# Altium schematic sheet SuCOELora.SchDoc
size A4; SheetNumber: 1; SheetTotal: 4
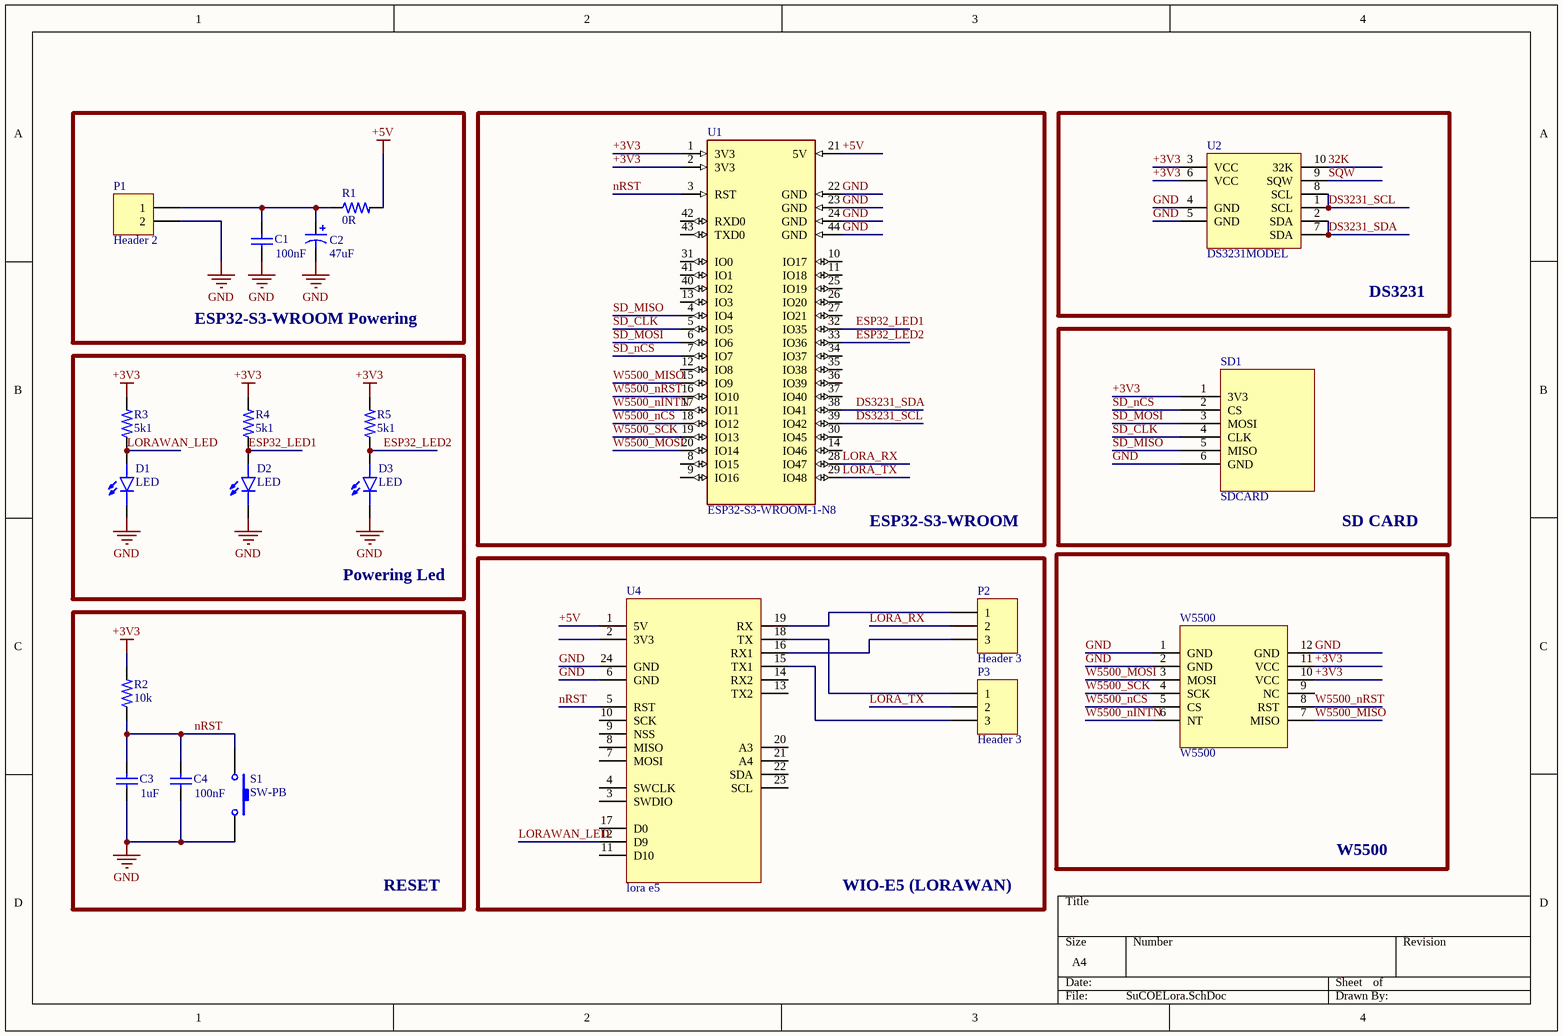
[diagram p0: SuCOELora.SchDoc]

## Parts
C1  value 100nF  [CC0805]  (hidden comment: 0805-50V-100nF±1%)
C2  value 47uF  [SMD-EC-F4]  (hidden comment: SMD-25V-47uF)
C3  value 1uF  [CC0805]  (hidden comment: 0805-50V-1uF±1%)
C4  value 100nF  [CC0805]  (hidden comment: 0805-50V-100nF±1%)
D1  LED  [LED-R3]
D2  LED  [LED-R3]
D3  LED  [LED-R3]
P1  Header 2  [2EDJKM3.81-2P]
P2  Header 3  [HDR1X3]
P3  Header 3  [HDR1X3]
R1  0R  [0805]
R2  10k  [0805]
R3  5k1  [0805]
R4  5k1  [0805]
R5  5k1  [0805]
S1  SW-PB  [KEY-4P]
SD1  SDCARD  [SDCARD]
U1  ESP32-S3-WROOM-1-N8  [ESP32-S3]
U2  DS3231MODEL  [DS3231]
U4  lora e5  [USB2.0-TYPE-C]
W5500  W5500  [W5500]

## Blocks framed on the sheet
ESP32-S3-WROOM Powering: C1 C2 P1 R1
ESP32-S3-WROOM: U1
DS3231: U2
SD CARD: SD1
Powering Led: D1-D3 R3-R5
WIO-E5 (LORAWAN): P2 P3 U4
W5500: W5500
RESET: C3 C4 R2 S1

## Nets
+3V3: R2.2 R3.2 R4.2 R5.2 SD1.1(3V3) U1.1(3V3) U1.2(3V3) U2.3(VCC) U2.6(VCC) W5500.10(VCC) W5500.11(VCC)
+5V: R1.2 U1.21(5V) U4.1(5V)
GND: C1.1 C2.2 C3.1 C4.1 D1.2(C) D2.2(C) D3.2(C) P1.2 S1.2 SD1.6(GND) U1.22(GND) U1.23(GND) U1.24(GND) U1.44(GND) U2.4(GND) U2.5(GND) U4.6(GND) U4.24(GND) W5500.1(GND) W5500.2(GND) W5500.12(GND)
32K: U2.10(32K)
DS3231_SCL: U1.39(IO42) U2.1(SCL) U2.8(SCL)
DS3231_SDA: U1.38(IO41) U2.2(SDA) U2.7(SDA)
ESP32_LED1: D2.1(A) R4.1 U1.32(IO35)
ESP32_LED2: D3.1(A) R5.1 U1.33(IO36)
LORA_RX: P2.2 U1.28(IO47)
LORA_TX: P3.2 U1.29(IO48)
LORAWAN_LED: D1.1(A) R3.1 U4.12(D9)
nRST: C3.2 C4.2 R2.1 S1.1 U1.3(RST) U4.5(RST)
SD_CLK: SD1.4(CLK) U1.5(IO5)
SD_MISO: SD1.5(MISO) U1.4(IO4)
SD_MOSI: SD1.3(MOSI) U1.6(IO6)
SD_nCS: SD1.2(CS) U1.7(IO7)
SQW: U2.9(SQW)
W5500_MISO: U1.15(IO9) W5500.7(MISO)
W5500_MOSI: U1.20(IO14) W5500.3(MOSI)
W5500_nCS: U1.18(IO12) W5500.5(CS)
W5500_nINTN: U1.17(IO11) W5500.6(NT)
W5500_nRST: U1.16(IO10) W5500.8(RST)
W5500_SCK: U1.19(IO13) W5500.4(SCK)
NetC1_2: C1.2 C2.1 P1.1 R1.1
NetP2_1: P2.1 U4.19(RX)
NetP2_3: P2.3 U4.16(RX1)
NetP3_1: P3.1 U4.18(TX)
NetP3_3: P3.3 U4.15(TX1)

Not connected (* = marked no-connect by the designer): U1 8(IO15) 9(IO16) 10(IO17) 11(IO18) 12(IO8) 13(IO3) 14(IO46) 25(IO19) 26(IO20) 27(IO21) 30(IO45) 31(IO0) 34(IO37) 35(IO38) 36(IO39) 37(IO40) 40(IO2) 41(IO1) 42(RXD0) 43(TXD0); U4 2(3V3) 3(SWDIO) 4(SWCLK) 7(MOSI) 8(MISO) 9(NSS) 10(SCK) 11(D10) 13(TX2) 14(RX2) 17(D0) 20(A3) 21(A4) 22(SDA) 23(SCL); W5500 9(NC)

## Library data of the parts
C1 C3 C4 = Cap: Capacitor; Published: 8-Jun-2000; LatestRevisionDate: 17-Jul-2002; LatestRevisionNote: Re-released for DXP Platform.; PackageReference: RAD-0.3; Publisher: Altium Limited; PackageDescription: Radial Cap, Thru-Hole; 2 Leads; 0.3 in Pin Spacing
C2 = Cap Pol1: Polarized Capacitor (Radial); Published: 8-Jun-2000; LatestRevisionDate: 17-Jul-2002; LatestRevisionNote: Re-released for DXP Platform.; PackageReference: RB7.6-15; Publisher: Altium Limited; PackageDescription: Polarized Capacitor (Radial); 2 Leads
D1-D3 = 597-3305-607F: LED Uni-Color Red 2-Pin Chip 0805 T/R; Availability: Unavailable; Value: *; Price: None; MP: 597-3305-607F; Package: None
P1 = Header 2: Header, 2-Pin; LatestRevisionDate: 17-Jul-2002; LatestRevisionNote: Re-released for DXP Platform.; Publisher: Altium Limited
P2 P3 = Header 3: Header, 3-Pin; LatestRevisionDate: 17-Jul-2002; LatestRevisionNote: Re-released for DXP Platform.; Publisher: Altium Limited
R1 = 0402 SMD Resistor: SMD Chip Resistor, Jumper, 0 ohm, 100 mW, 0402 [1005 Metric], Thick Film, General Purpose; Manufacturer: Panasonic; Manufacturer Part Number: ERJ-2GE0R00X; Value: 0mR; Power Rating: 100mW; Voltage Rating: 50V; Temperature Coefficient: 600ppm/°C; ComponentLink1Description: Link; ComponentLink1URL: *; Supplier: Mouser; Supplier Part Number: 667-ERJ-2GE0R00X; RoHS: Yes; Category: Chip SMD Resistors; Stock: 616486; Pricing: 1=0.1, 10=0.013, 50=0.013, 100=0.008, 1000=0.006, 10000=0.004 (USD); Mounting Technology: Surface Mount; Case/Package: 0402; Pins: 2NUMBER; Contact Plating: Tin; Case Code (Metric): 1005; Case Code (Imperial): 0402; Min Operating Temperature: -55°C; Max Operating Temperature: 155°C; Resistor Type: Thick Film; Packaging: Cut Tape; Package Quantity: 10000; Number of Terminations: 2; Termination: SMD/SMT; Max Power Dissipation: 100mW; Features: Automotive AEC-Q200; Series: ERJ; Construction: Rectangular; Technology: THICK FILM; Voltage Rating (DC): 50V; Length: 1mm; Width: 0.5mm; Height: 0.35mm; Depth: 0.5mm; Ratings: AEC-Q200; Radiation Hardening: No; Reach SVHC Compliant: No; Military Standard: Not; RoHS Compliant: Yes; Lead Free: 5697LeadFree; ComponentLink2URL: https://datasheet.ciiva.com/11821/0900766b80f806dd-11821176.pdf?src-supplier=Rs; ComponentLink2Description: https://datasheet.ciiva.com/11821/0900766b80f806dd-11821176.pdf?src-supplier=Rs; ComponentLink3URL: https://datasheet.ciiva.com/46389/1678796-46389518.pdf?src-supplier=Element14; ComponentLink3Description: https://datasheet.ciiva.com/46389/1678796-46389518.pdf?src-supplier=Element14; ComponentLink4URL: https://datasheet.ciiva.com/28695/1678796-28695758.pdf?src-supplier=Element14; ComponentLink4Description: https://datasheet.ciiva.com/28695/1678796-28695758.pdf?src-supplier=Element14; ComponentLink5URL: https://datasheet.ciiva.com/16778/70260739-16778335.pdf?src-supplier=Allied+Electronics; ComponentLink5Description: https://datasheet.ciiva.com/16778/70260739-16778335.pdf?src-supplier=Allied+Electronics; ComponentLink6URL: https://datasheet.ciiva.com/48531/aoa0000ce1-48531077.pdf?src-supplier=Avnet; ComponentLink6Description: https://datasheet.ciiva.com/48531/aoa0000ce1-48531077.pdf?src-supplier=Avnet; ComponentLink7URL: https://datasheet.ciiva.com/30097/4aoa0000ce1-30097116.pdf?src-supplier=Onlinecomponents.com; ComponentLink7Description: https://datasheet.ciiva.com/30097/4aoa0000ce1-30097116.pdf?src-supplier=Onlinecomponents.com; ComponentLink8URL: https://datasheet.ciiva.com/43460/1678796-43460347.pdf?src-supplier=Farnell; ComponentLink8Description: https://datasheet.ciiva.com/43460/1678796-43460347.pdf?src-supplier=Farnell; ComponentLink9URL: https://datasheet.ciiva.com/5959/1678796-5959692.pdf?src-supplier=Farnell; ComponentLink9Description: https://datasheet.ciiva.com/5959/1678796-5959692.pdf?src-supplier=Farnell; ComponentLink10URL: https://datasheet.ciiva.com/16783/70260739-16783734.pdf?src-supplier=Allied+Electronics; ComponentLink10Description: https://datasheet.ciiva.com/16783/70260739-16783734.pdf?src-supplier=Allied+Electronics
R2 = 0402 SMD Resistor: Res Thick Film 0402 10K Ohm 5% 0.125W(1/8W) ±200ppm/C Pad SMD T/R; Manufacturer: Yageo; Manufacturer Part Number: RC0402JR-7W10KL; Value: 10kR; ComponentLink1Description: Link; ComponentLink1URL: *; Supplier: Future Electronics; Supplier Part Number: 5143940; RoHS: Yes; Category: Chip SMD Resistors; Stock: 480000; Pricing: 10000=0.0009, 50000=0.0009, 200000=0.0009, 500000=0.0009, 1250000=0.0009 (USD); Case/Package: 343Case; Packaging: 10Packaging; RoHS Compliant: Yes; ComponentLink2URL: https://datasheet.octopart.com/RC0402JR-7W10KL-Yageo-datasheet-164759695.pdf?src-supplier=Future+Electronics; ComponentLink2Description: https://datasheet.octopart.com/RC0402JR-7W10KL-Yageo-datasheet-164759695.pdf?src-supplier=Future+Electronics
R3-R5 = 0402 SMD Resistor: General Purpose Chip Resistor Thick Film 0402 5.1kOhm 1% Paper T/R; Manufacturer: Yageo; Manufacturer Part Number: RC0402FR-7W5K1L; Value: 5.1kR; Resistance: *; Part Number: *; ComponentLink1Description: Link; ComponentLink1URL: *; Tolerance: *; Wattage: *; Supplier: Digikey; Supplier Part Number: 13-RC0402FR-7W5K1LCT-ND; RoHS: Yes; Category: Chip SMD Resistors; Stock: 6352; Pricing: 1=0.1, 10=0.021, 50=0.0164, 100=0.0112, 500=0.00868, 1000=0.00612, 5000=0.0051 (USD); Case/Package: 343Case; Packaging: 10Packaging; RoHS Compliant: Yes
S1 = SW-PB: Switch; Published: 24-Mar-1999; LatestRevisionDate: 17-Jul-2002; LatestRevisionNote: Re-released for DXP Platform.; PackageReference: SPST-2; Publisher: Altium Limited; PackageDescription: Switch; 2 Leads
U1 = ESP32-S3-WROOM-1-N8: <a href="https://pricing.snapeda.com/parts/ESP32S3WROOM1N8R8/Espressif%20Systems/view-part?ref=eda">Check availability</a>  <a href="https://pricing.snapeda.com/parts/ESP32-S3-WROOM-1-N8R8/Espressif%20Systems/view-part?ref=eda">Check availability</a>; pin to pad: 1>1+40+41_1+41_2+41_3+41_4+41_5+41_6+41_7+41_8+41_9+41_10+41_11+41_12+41_13+41_14+41_15+41_16+41_17+41_18+41_19+41_20+41_21; MF: {'manufacturer': u'Espressif Systems'}; Package: None; Price: None; Value: *; MP: ESP32-S3-WROOM-1-N8; Availability: Unavailable